# Altium schematic sheet connect_board.SchDoc
size A3; SheetNumber: 4; SheetTotal: 5
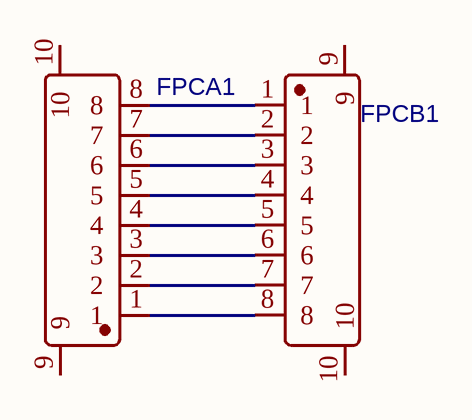
[diagram p0: connect_board.SchDoc]

## Parts
FPCA1  FFC 05 8P  [FFC-SMD_8P-P0.50]  (value not drawn)
FPCB1  FFC 05 8P  [FFC-SMD_8P-P0.50]  (value not drawn)

## Nets
NetFPCA1_1: FPCA1.1 FPCB1.8
NetFPCA1_2: FPCA1.2 FPCB1.7
NetFPCA1_3: FPCA1.3 FPCB1.6
NetFPCA1_4: FPCA1.4 FPCB1.5
NetFPCA1_5: FPCA1.5 FPCB1.4
NetFPCA1_6: FPCA1.6 FPCB1.3
NetFPCA1_7: FPCA1.7 FPCB1.2
NetFPCA1_8: FPCA1.8 FPCB1.1

Not connected (* = marked no-connect by the designer): FPCA1 9 10; FPCB1 9 10

## Library data of the parts
FPCA1 FPCB1 = FFC 05 8P: Manufacturer: TXGA(特思嘉); Manufacturer Part: FFC05001-08SBB124W5M-H; Contributor: LCSC; Supplier: LCSC; Supplier Part: C456420; JLCPCB Part Class: Extended Part; spicePre: F; spiceSymbolName: FFC05001-08SBB124W5M-H